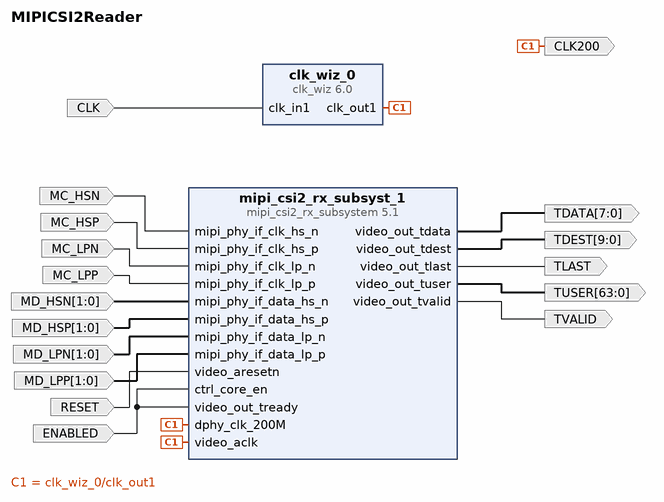
[diagram p0: block diagram of the top level]
# Vivado block design MIPICSI2Reader, xc7a35tftg256-1, Vivado 2020.2
create_bd_design MIPICSI2Reader

create_bd_port -dir I -type rst RESET
set_property -dict {CONFIG.POLARITY ACTIVE_LOW} [get_bd_ports RESET]
create_bd_port -dir I -type data ENABLED
create_bd_port -dir I -type clk CLK
set_property -dict {CONFIG.FREQ_HZ 100000000} [get_bd_ports CLK]
create_bd_port -dir I -from 1 -to 0 MD_HSP
create_bd_port -dir I -from 1 -to 0 -type data MD_HSN
create_bd_port -dir I -from 1 -to 0 -type data MD_LPN
create_bd_port -dir I -from 1 -to 0 -type data MD_LPP
create_bd_port -dir I -type clk MC_HSN
set_property -dict {CONFIG.FREQ_HZ 800000000} [get_bd_ports MC_HSN]
create_bd_port -dir I -type clk MC_HSP
set_property -dict {CONFIG.FREQ_HZ 800000000} [get_bd_ports MC_HSP]
create_bd_port -dir I -type clk MC_LPN
set_property -dict {CONFIG.FREQ_HZ 800000000} [get_bd_ports MC_LPN]
create_bd_port -dir I -type clk MC_LPP
set_property -dict {CONFIG.FREQ_HZ 800000000} [get_bd_ports MC_LPP]
create_bd_port -dir O -type data TVALID
create_bd_port -dir O -type data TLAST
create_bd_port -dir O -from 7 -to 0 -type data TDATA
create_bd_port -dir O -from 9 -to 0 -type data TDEST
create_bd_port -dir O -type clk CLK200
create_bd_port -dir O -from 63 -to 0 -type data TUSER

create_bd_cell -type ip -vlnv xilinx.com:ip:mipi_csi2_rx_subsystem:5.1 mipi_csi2_rx_subsyst_1
set_property -dict [list \
  CONFIG.CMN_NUM_LANES 2 \
  CONFIG.CSI_CONTROLLER_REG_IF false \
  CONFIG.CSI_EMB_NON_IMG false \
  CONFIG.C_CSI_EN_ACTIVELANES true \
  CONFIG.C_DPHY_LANES 2 \
  CONFIG.C_EN_7S_LINERATE_CHECK false \
  CONFIG.C_EN_CSI_V2_0 true \
  CONFIG.C_EXDES_BOARD VCK190 \
  CONFIG.VFB_TU_WIDTH 64 \
] [get_bd_cells mipi_csi2_rx_subsyst_1]
create_bd_cell -type ip -vlnv xilinx.com:ip:clk_wiz:6.0 clk_wiz_0
set_property -dict [list \
  CONFIG.CLKOUT1_JITTER 114.829 \
  CONFIG.CLKOUT1_REQUESTED_OUT_FREQ 200 \
  CONFIG.MMCM_CLKOUT0_DIVIDE_F 5.000 \
  CONFIG.USE_LOCKED false \
  CONFIG.USE_RESET false \
] [get_bd_cells clk_wiz_0]

# ---- connections ----

connect_bd_net [get_bd_pins clk_wiz_0/clk_out1] \
  [get_bd_ports CLK200] [get_bd_pins mipi_csi2_rx_subsyst_1/video_aclk] [get_bd_pins mipi_csi2_rx_subsyst_1/dphy_clk_200M]
connect_bd_net [get_bd_pins mipi_csi2_rx_subsyst_1/video_out_tdata] [get_bd_ports TDATA]
connect_bd_net [get_bd_pins mipi_csi2_rx_subsyst_1/video_out_tdest] [get_bd_ports TDEST]
connect_bd_net [get_bd_pins mipi_csi2_rx_subsyst_1/video_out_tlast] [get_bd_ports TLAST]
connect_bd_net [get_bd_pins mipi_csi2_rx_subsyst_1/video_out_tvalid] [get_bd_ports TVALID]
connect_bd_net [get_bd_ports MC_HSN] [get_bd_pins mipi_csi2_rx_subsyst_1/mipi_phy_if_clk_hs_n]
connect_bd_net [get_bd_ports MC_HSP] [get_bd_pins mipi_csi2_rx_subsyst_1/mipi_phy_if_clk_hs_p]
connect_bd_net [get_bd_ports MC_LPN] [get_bd_pins mipi_csi2_rx_subsyst_1/mipi_phy_if_clk_lp_n]
connect_bd_net [get_bd_ports MC_LPP] [get_bd_pins mipi_csi2_rx_subsyst_1/mipi_phy_if_clk_lp_p]
connect_bd_net [get_bd_ports MD_HSN] [get_bd_pins mipi_csi2_rx_subsyst_1/mipi_phy_if_data_hs_n]
connect_bd_net [get_bd_ports MD_HSP] [get_bd_pins mipi_csi2_rx_subsyst_1/mipi_phy_if_data_hs_p]
connect_bd_net [get_bd_ports MD_LPN] [get_bd_pins mipi_csi2_rx_subsyst_1/mipi_phy_if_data_lp_n]
connect_bd_net [get_bd_ports MD_LPP] [get_bd_pins mipi_csi2_rx_subsyst_1/mipi_phy_if_data_lp_p]
connect_bd_net [get_bd_ports RESET] [get_bd_pins mipi_csi2_rx_subsyst_1/video_aresetn]
connect_bd_net [get_bd_ports ENABLED] [get_bd_pins mipi_csi2_rx_subsyst_1/ctrl_core_en] [get_bd_pins mipi_csi2_rx_subsyst_1/video_out_tready]
connect_bd_net [get_bd_pins mipi_csi2_rx_subsyst_1/video_out_tuser] [get_bd_ports TUSER]
connect_bd_net [get_bd_ports CLK] [get_bd_pins clk_wiz_0/clk_in1]

validate_bd_design
save_bd_design
